# Altium project master.PrjPcb (part 4 of 4)
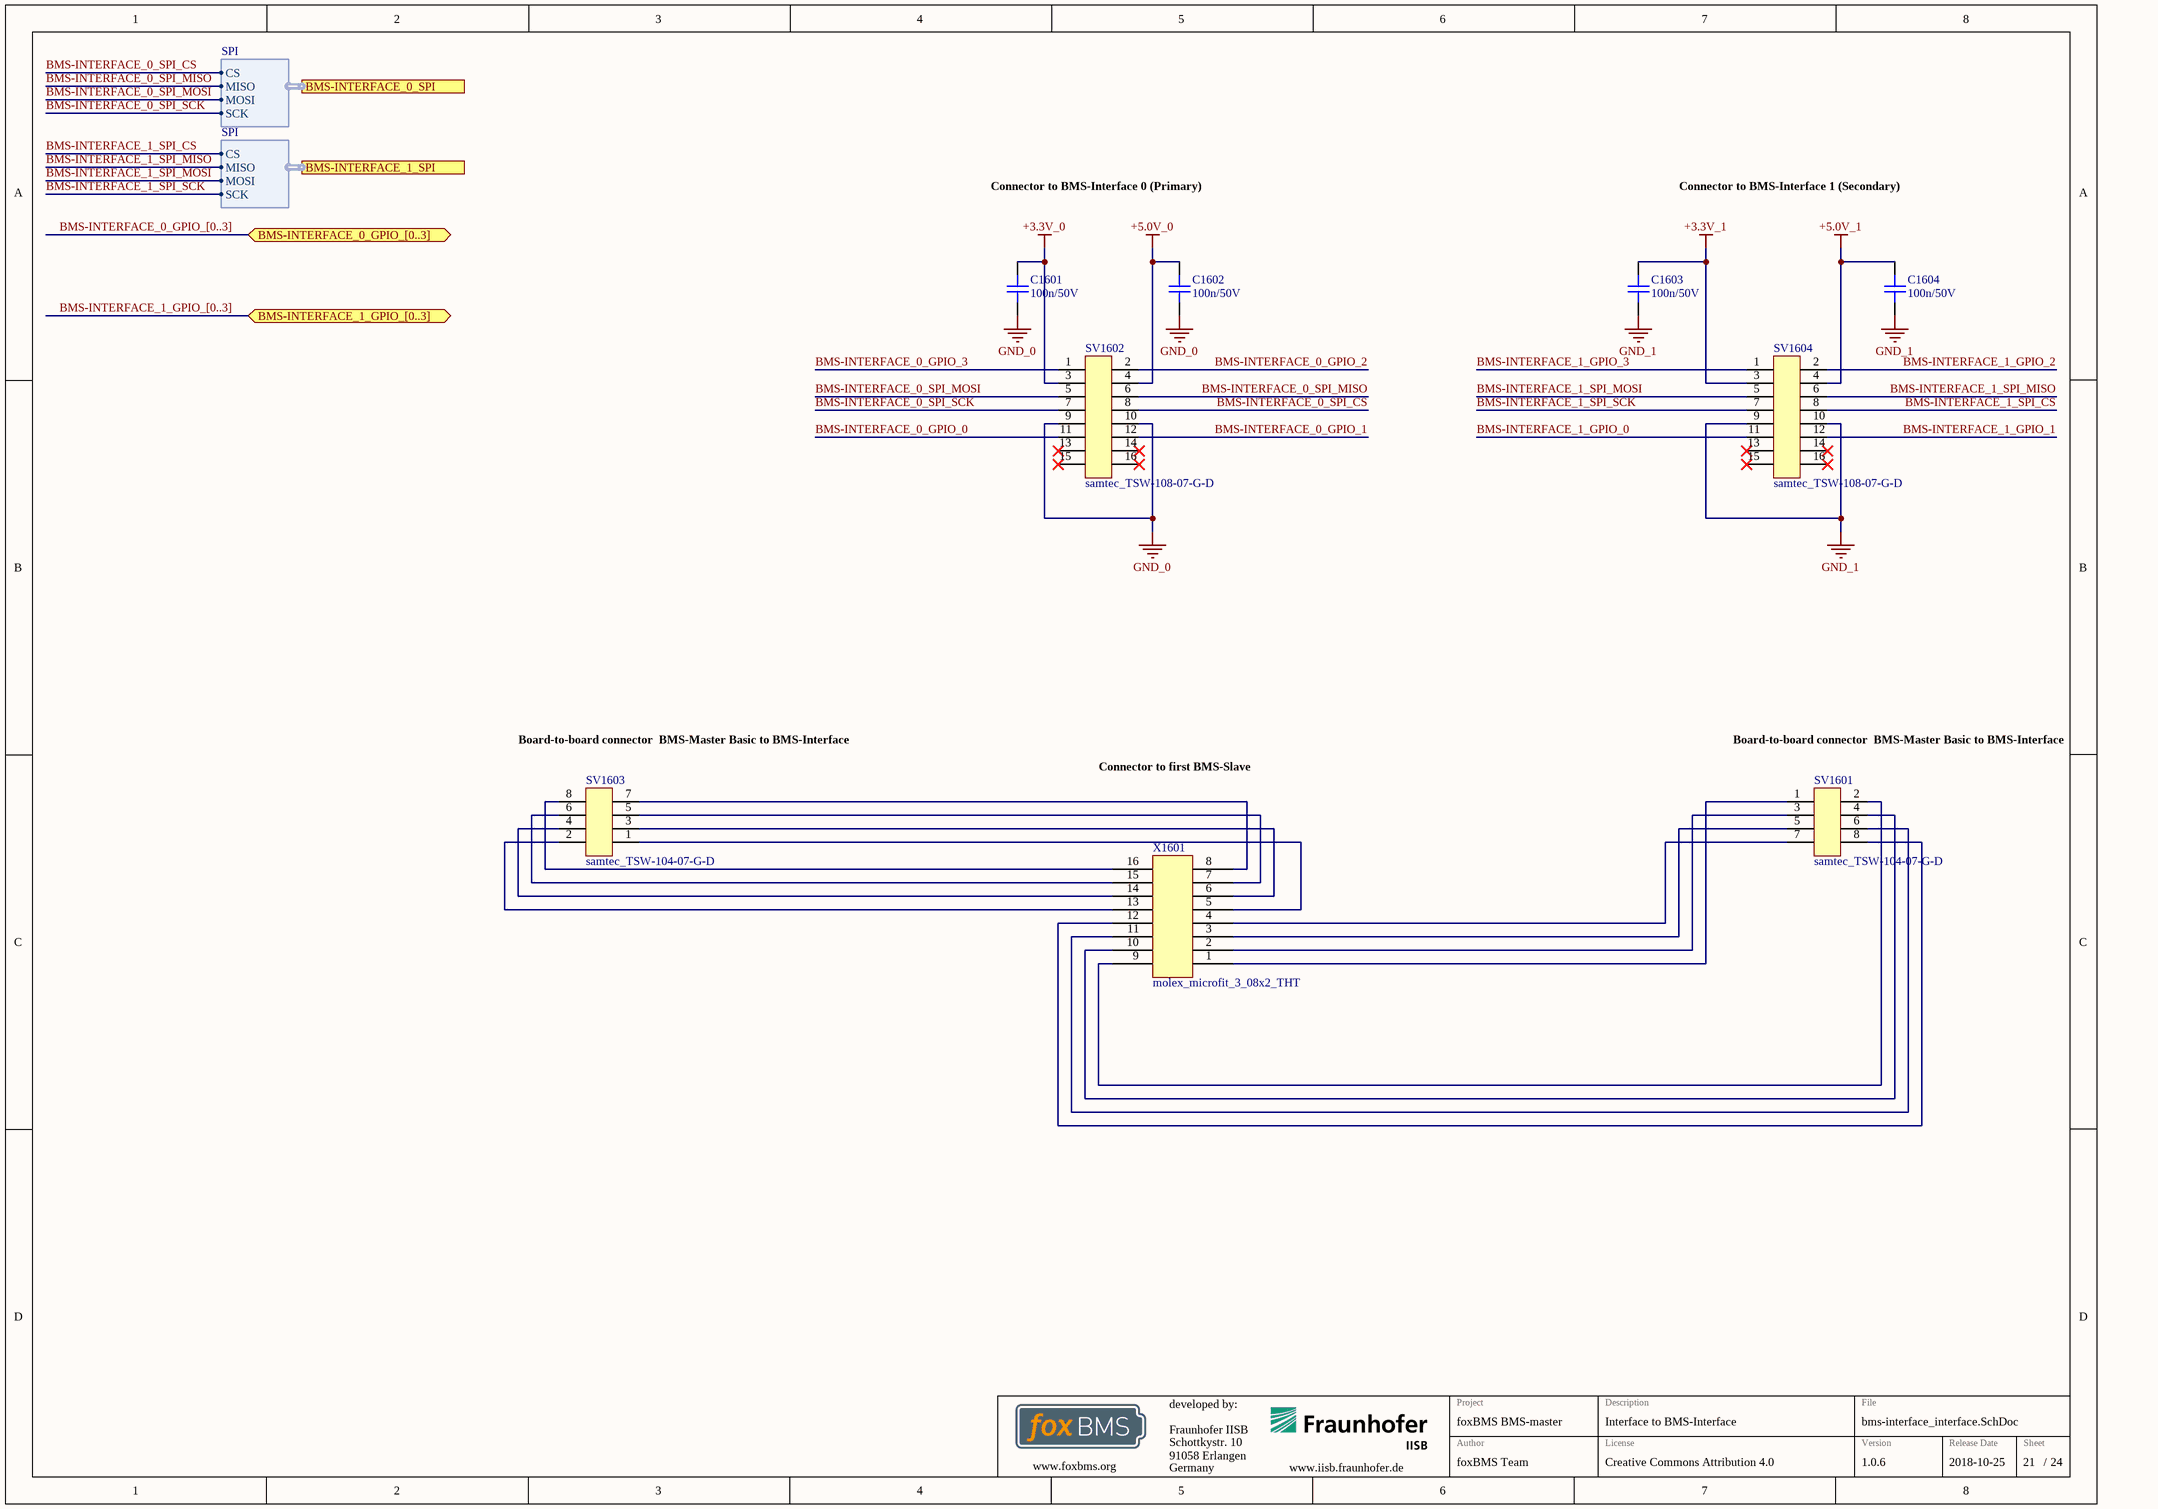
[diagram p24: bms-interface_interface.SchDoc]

## Nets that join several sheets
+3.3V_0: FPGA_SPI_interface (C2101.2 SV2101.2), supply0 (5 pins), mcu0_primary (C430.1 IC402.171 R405.2 X403.1), ext_bootload_activation (R402.2 T401.2 X402.1), power (30 pins), adc_reference (C403.1 C408.1 IC401.3 IC401.4), analog_supply_decoupling (C404.1 L401.1), SDRAM (14 pins), CAN0 (C807.2 IC802.1 IC803.1), mcu0_to_mcu1_isolated_SPI (C601.2 IC601.10 IC601.16), bender_isometer_interface (C707.1 IC702.10 IC702.16), isolated_USB (C1405.1 IC1403.10 IC1403.16), connector_to_BMS_extension (JP2201.2 JP2201.4 JP2202.2 JP2202.4), interlock_circuit (IC902.4 IC904.1), contactor_control (6 pins), contactor_feedback (6 pins), EEPROM (C1501.2 IC1501.8 R1501.2 R1502.2), bms-interface_interface (C1601.1 SV1602.3)
+3.3V_1: supply1 (5 pins), mcu0_to_mcu1_isolated_SPI (C602.1 IC601.1 IC601.7), isolated_USB (C1410.1 IC1406.10 IC1406.16), mcu1_secondary (23 pins), interlock_circuit (IC903.4 IC905.1), bms-interface_interface (C1603.1 SV1604.3)
+5.0V_0: FPGA_SPI_interface (C2102.1 SV2101.1), supply0 (5 pins), bms-interface_interface (C1602.1 SV1602.4)
+5.0V_1: supply1 (5 pins), bms-interface_interface (C1604.1 SV1604.4)
GND_0: FPGA_SPI_interface (C2101.1 C2102.2 SV2101.5 SV2101.6), supply0 (9 pins), mcu0_primary (16 pins), crystals (6 pins), debug_LED (R408.1 R409.1), ext_bootload_activation (R401.1), power (30 pins), adc_reference (5 pins), analog_supply_decoupling (C404.2 C411.2), SDRAM (14 pins), CAN0 (6 pins), mcu0_to_mcu1_isolated_SPI (C601.1 IC601.9 IC601.15), bender_isometer_interface (6 pins), isolated_USB (C1405.2 IC1403.9 IC1403.15), connector_to_BMS_extension (JP2201.1 JP2201.3 JP2202.1 JP2202.3), interlock_circuit (R903.1 R908.2 T902.S), contactor_control (12 pins), contactor_feedback (6 pins), EEPROM (C1501.1 IC1501.4), bms-interface_interface (C1601.2 C1602.2 SV1602.9 SV1602.10)
GND_1: supply1 (9 pins), mcu0_to_mcu1_isolated_SPI (C602.2 IC601.2 IC601.8), isolated_USB (C1410.2 IC1406.9 IC1406.15), mcu1_secondary (34 pins), interlock_circuit (R904.1 R911.2 T903.S), bms-interface_interface (C1603.2 C1604.2 SV1604.9 SV1604.10)
GND_EXT_0: supply0 (7 pins), supply1 (C302.2 C303.2 C304.2 IC302.1), CAN0 (13 pins), bender_isometer_interface (15 pins), interlock_circuit (SV901.2), contactor_feedback (16 pins), contactor_connectors (6 pins)
GND_EXT_2: supply0 (X201.3 X201.6), interlock_circuit (9 pins)
SUPPLY_EXT_0: supply0 (6 pins), supply1 (C302.1 C303.1 C304.1 IC302.2), CAN0 (C801.2 C802.2 IC801.1), bender_isometer_interface (C701.1 C702.1 IC701.3 X701.2), interlock_circuit (SV901.3), contactor_feedback (C1101.1 C1102.1 IC1101.3)
SUPPLY_EXT_2: supply0 (X201.1 X201.2), interlock_circuit (R901.2 SV901.5 SV901.7), contactor_control (12 pins)
ADC_MCU_0_CH_0: mcu0_primary (IC402.54), connector_to_BMS_extension (JP2202.7)
ADC_MCU_0_CH_1: mcu0_primary (IC402.55), connector_to_BMS_extension (JP2202.8)
ADC_MCU_0_CH_2: mcu0_primary (IC402.56), connector_to_BMS_extension (JP2202.5)
ADC_MCU_0_CH_3: mcu0_primary (IC402.57), connector_to_BMS_extension (JP2202.6)
ADC_MCU_0_CH_4: mcu0_primary (IC402.41), connector_to_BMS_extension (JP2202.10)
BENDER_OK: mcu0_primary (IC402.46), bender_isometer_interface (IC702.14 R708.2)
BENDER_PWM: mcu0_primary (IC402.47), bender_isometer_interface (IC702.13 R709.2)
BENDER_SUPPLY_ENABLE: mcu0_primary (IC402.43), bender_isometer_interface (IC702.12 R710.2)
BMS-INTERFACE_0_SPI_CS: mcu0_primary (IC402.50), bms-interface_interface (SV1602.8)
BMS-INTERFACE_0_SPI_MISO: mcu0_primary (IC402.52), bms-interface_interface (SV1602.6)
BMS-INTERFACE_0_SPI_MOSI: mcu0_primary (IC402.53), bms-interface_interface (SV1602.5)
BMS-INTERFACE_0_SPI_SCK: mcu0_primary (IC402.51), bms-interface_interface (SV1602.7)
BMS-INTERFACE_1_GPIO_0: mcu1_secondary (IC501.69), bms-interface_interface (SV1604.11)
BMS-INTERFACE_1_GPIO_1: mcu1_secondary (IC501.70), bms-interface_interface (SV1604.12)
BMS-INTERFACE_1_GPIO_2: mcu1_secondary (IC501.71), bms-interface_interface (SV1604.2)
BMS-INTERFACE_1_GPIO_3: mcu1_secondary (IC501.90), bms-interface_interface (SV1604.1)
BMS-INTERFACE_1_SPI_CS: mcu1_secondary (IC501.29), bms-interface_interface (SV1604.8)
BMS-INTERFACE_1_SPI_MISO: mcu1_secondary (IC501.31), bms-interface_interface (SV1604.6)
BMS-INTERFACE_1_SPI_MOSI: mcu1_secondary (IC501.32), bms-interface_interface (SV1604.5)
BMS-INTERFACE_1_SPI_SCK: mcu1_secondary (IC501.30), bms-interface_interface (SV1604.7)
BOOT_0_MCU_0: mcu0_primary (IC402.166), ext_bootload_activation (R401.2 T401.3 X402.2)
CAN_0_RX: mcu0_primary (IC402.163), CAN0 (IC802.5)
CAN_0_TRANS_STANDBY_CONTROL: mcu0_primary (IC402.141), CAN0 (R806.2)
CAN_0_TX: mcu0_primary (IC402.93), CAN0 (IC802.3)
CAN_1_RX: mcu0_primary (IC402.167), connector_to_BMS_extension (JP2201.5)
CAN_1_TRANS_STANDBY_CONTROL: mcu0_primary (IC402.165), connector_to_BMS_extension (JP2201.6)
CAN_1_TX: mcu0_primary (IC402.168), connector_to_BMS_extension (JP2201.8)
CONTACTOR_0_COIL_POS: contactor_control (D1001.1 F1001.2), contactor_connectors (X1201.3)
CONTACTOR_0_CONTROL: mcu0_primary (IC402.133), contactor_control (R1001.2)
CONTACTOR_0_FEEDBACK: mcu0_primary (IC402.128), contactor_feedback (IC1102.14)
CONTACTOR_0_FEEDBACK_EXT: contactor_feedback (R1101.1), contactor_connectors (X1201.2)
CONTACTOR_1_COIL_POS: contactor_control (D1003.1 F1003.2), contactor_connectors (X1203.3)
CONTACTOR_1_CONTROL: mcu0_primary (IC402.132), contactor_control (R1007.2)
CONTACTOR_1_FEEDBACK: mcu0_primary (IC402.129), contactor_feedback (IC1102.13)
CONTACTOR_1_FEEDBACK_EXT: contactor_feedback (R1102.1), contactor_connectors (X1203.2)
CONTACTOR_2_COIL_POS: contactor_control (D1005.1 F1005.2), contactor_connectors (X1205.3)
CONTACTOR_2_CONTROL: mcu0_primary (IC402.131), contactor_control (R1013.2)
CONTACTOR_2_FEEDBACK: mcu0_primary (IC402.130), contactor_feedback (IC1102.12)
CONTACTOR_2_FEEDBACK_EXT: contactor_feedback (R1103.1), contactor_connectors (X1205.2)
CONTACTOR_3_COIL_POS: contactor_control (D1002.1 F1002.2), contactor_connectors (X1202.3)
CONTACTOR_3_CONTROL: mcu0_primary (IC402.120), contactor_control (R1002.2)
CONTACTOR_3_FEEDBACK: mcu0_primary (IC402.115), contactor_feedback (IC1103.14)
CONTACTOR_3_FEEDBACK_EXT: contactor_feedback (R1104.2), contactor_connectors (X1202.2)
CONTACTOR_4_COIL_POS: contactor_control (D1004.1 F1004.2), contactor_connectors (X1204.3)
CONTACTOR_4_CONTROL: mcu0_primary (IC402.119), contactor_control (R1008.2)
CONTACTOR_4_FEEDBACK: mcu0_primary (IC402.116), contactor_feedback (IC1103.13)
CONTACTOR_4_FEEDBACK_EXT: contactor_feedback (R1105.2), contactor_connectors (X1204.2)
CONTACTOR_5_COIL_POS: contactor_control (D1006.1 F1006.2), contactor_connectors (X1206.3)
CONTACTOR_5_CONTROL: mcu0_primary (IC402.118), contactor_control (R1014.2)
CONTACTOR_5_FEEDBACK: mcu0_primary (IC402.117), contactor_feedback (IC1103.12)
CONTACTOR_5_FEEDBACK_EXT: contactor_feedback (R1106.2), contactor_connectors (X1206.2)
CONTACTOR_6_CONTROL: mcu0_primary (IC402.139), connector_to_BMS_extension (JP2201.17)
CONTACTOR_6_FEEDBACK: mcu0_primary (IC402.140), connector_to_BMS_extension (JP2201.18)
CONTACTOR_7_CONTROL: mcu0_primary (IC402.144), connector_to_BMS_extension (JP2201.15)
CONTACTOR_7_FEEDBACK: mcu0_primary (IC402.164), connector_to_BMS_extension (JP2201.16)
CONTACTOR_8_CONTROL: mcu0_primary (IC402.44), connector_to_BMS_extension (JP2202.9)
CONTACTOR_8_FEEDBACK: mcu0_primary (IC402.45), connector_to_BMS_extension (JP2202.12)
CONTACTORS_COMMON_NEG: interlock_circuit (T901.4), contactor_control (6 pins), contactor_connectors (6 pins)
DATA_STORAGE_SPI_EEPROM_CS: mcu0_primary (IC402.7), EEPROM (IC1501.1)
DATA_STORAGE_SPI_Memory_NSS: mcu0_primary (IC402.11), connector_to_BMS_extension (JP2201.24)
DATA_STORAGE_SPI_MISO: mcu0_primary (IC402.155), connector_to_BMS_extension (JP2201.22), EEPROM (IC1501.2)
DATA_STORAGE_SPI_MOSI: mcu0_primary (IC402.157), connector_to_BMS_extension (JP2201.20), EEPROM (IC1501.5)
DATA_STORAGE_SPI_SCK: mcu0_primary (IC402.156), connector_to_BMS_extension (JP2201.19), EEPROM (IC1501.6)
DEBUG_LED_0_MCU_0: mcu0_primary (IC402.35), debug_LED (LED402.2)
DEBUG_LED_1_MCU_0: mcu0_primary (IC402.34), debug_LED (LED401.2)
FMC_MCU_0_RAM_A0: mcu0_primary (IC402.16), SDRAM (IC1801.23)
FMC_MCU_0_RAM_A1: mcu0_primary (IC402.17), SDRAM (IC1801.24)
FMC_MCU_0_RAM_A2: mcu0_primary (IC402.18), SDRAM (IC1801.25)
FMC_MCU_0_RAM_A3: mcu0_primary (IC402.19), SDRAM (IC1801.26)
FMC_MCU_0_RAM_A4: mcu0_primary (IC402.20), SDRAM (IC1801.29)
FMC_MCU_0_RAM_A5: mcu0_primary (IC402.21), SDRAM (IC1801.30)
FMC_MCU_0_RAM_A6: mcu0_primary (IC402.60), SDRAM (IC1801.31)
FMC_MCU_0_RAM_A7: mcu0_primary (IC402.63), SDRAM (IC1801.32)
FMC_MCU_0_RAM_A8: mcu0_primary (IC402.64), SDRAM (IC1801.33)
FMC_MCU_0_RAM_A9: mcu0_primary (IC402.65), SDRAM (IC1801.34)
FMC_MCU_0_RAM_A10: mcu0_primary (IC402.66), SDRAM (IC1801.22)
FMC_MCU_0_RAM_A11: mcu0_primary (IC402.67), SDRAM (IC1801.35)
FMC_MCU_0_RAM_BA0: mcu0_primary (IC402.108), SDRAM (IC1801.20)
FMC_MCU_0_RAM_BA1: mcu0_primary (IC402.109), SDRAM (IC1801.21)
FMC_MCU_0_RAM_D0: mcu0_primary (IC402.104), SDRAM (IC1801.2)
FMC_MCU_0_RAM_D1: mcu0_primary (IC402.105), SDRAM (IC1801.4)
FMC_MCU_0_RAM_D2: mcu0_primary (IC402.142), SDRAM (IC1801.5)
FMC_MCU_0_RAM_D3: mcu0_primary (IC402.143), SDRAM (IC1801.7)
FMC_MCU_0_RAM_D4: mcu0_primary (IC402.68), SDRAM (IC1801.8)
FMC_MCU_0_RAM_D5: mcu0_primary (IC402.69), SDRAM (IC1801.10)
FMC_MCU_0_RAM_D6: mcu0_primary (IC402.70), SDRAM (IC1801.11)
FMC_MCU_0_RAM_D7: mcu0_primary (IC402.73), SDRAM (IC1801.13)
FMC_MCU_0_RAM_D8: mcu0_primary (IC402.74), SDRAM (IC1801.42)
FMC_MCU_0_RAM_D9: mcu0_primary (IC402.75), SDRAM (IC1801.44)
FMC_MCU_0_RAM_D10: mcu0_primary (IC402.76), SDRAM (IC1801.45)
FMC_MCU_0_RAM_D11: mcu0_primary (IC402.77), SDRAM (IC1801.47)
FMC_MCU_0_RAM_D12: mcu0_primary (IC402.78), SDRAM (IC1801.48)
FMC_MCU_0_RAM_D13: mcu0_primary (IC402.96), SDRAM (IC1801.50)
FMC_MCU_0_RAM_D14: mcu0_primary (IC402.97), SDRAM (IC1801.51)
FMC_MCU_0_RAM_D15: mcu0_primary (IC402.98), SDRAM (IC1801.53)
FMC_MCU_0_RAM_NBL0: mcu0_primary (IC402.169), SDRAM (IC1801.15)
FMC_MCU_0_RAM_NBL1: mcu0_primary (IC402.170), SDRAM (IC1801.39)
FMC_MCU_0_RAM_SDCKE1: mcu0_primary (IC402.84), SDRAM (IC1801.37)
FMC_MCU_0_RAM_SDCLK: mcu0_primary (IC402.112), SDRAM (IC1801.38)
FMC_MCU_0_RAM_SDNCAS: mcu0_primary (IC402.160), SDRAM (IC1801.17)
FMC_MCU_0_RAM_SDNE1: mcu0_primary (IC402.83), SDRAM (IC1801.19)
FMC_MCU_0_RAM_SDNRAS: mcu0_primary (IC402.59), SDRAM (IC1801.18)
FMC_MCU_0_RAM_SDNWE: mcu0_primary (IC402.32), SDRAM (IC1801.16)
FTDI_MCU_0_DTR: ext_bootload_activation (R402.1 T401.1), isolated_USB (IC1403.13)
FTDI_MCU_0_RTS: mcu0_primary (R403.2), isolated_USB (IC1403.14)
FTDI_MCU_0_RX: mcu0_primary (IC402.80), isolated_USB (IC1403.12)
FTDI_MCU_0_TX: mcu0_primary (IC402.79), isolated_USB (IC1403.11)
FTDI_MCU_1_DTR: isolated_USB (IC1406.13), mcu1_secondary (R504.1 T501.1)
FTDI_MCU_1_RTS: isolated_USB (IC1406.14), mcu1_secondary (R501.2)
FTDI_MCU_1_RX: isolated_USB (IC1406.12), mcu1_secondary (IC501.48)
FTDI_MCU_1_TX: isolated_USB (IC1406.11), mcu1_secondary (IC501.47)
HSE_1_MCU_0: mcu0_primary (IC402.29), crystals (C402.2 Q401.1)
HSE_2_MCU_0: mcu0_primary (IC402.30), crystals (C414.1 Q401.3)
INTERLOCK_CONTROL_MCU_0: mcu0_primary (IC402.146), interlock_circuit (R909.2)
INTERLOCK_CONTROL_MCU_1: mcu1_secondary (IC501.85), interlock_circuit (R912.2)
INTERLOCK_FEEDBACK_MCU_0: mcu0_primary (IC402.147), interlock_circuit (IC902.3 R903.2)
INTERLOCK_FEEDBACK_MCU_1: mcu1_secondary (IC501.86), interlock_circuit (IC903.3 R904.2)
ISO_GPIO_MCU_0_IN_0: mcu0_primary (IC402.100), connector_to_BMS_extension (JP2202.21)
ISO_GPIO_MCU_0_IN_1: mcu0_primary (IC402.101), connector_to_BMS_extension (JP2202.24)
ISO_GPIO_MCU_0_IN_2: mcu0_primary (IC402.154), connector_to_BMS_extension (JP2201.14)
ISO_GPIO_MCU_0_IN_3: mcu0_primary (IC402.173), connector_to_BMS_extension (JP2201.9)
ISO_GPIO_MCU_0_OUT_0: mcu0_primary (IC402.152), connector_to_BMS_extension (JP2201.10)
ISO_GPIO_MCU_0_OUT_1: mcu0_primary (IC402.153), connector_to_BMS_extension (JP2201.13)
ISO_GPIO_MCU_0_OUT_2: mcu0_primary (IC402.174), connector_to_BMS_extension (JP2201.12)
ISO_GPIO_MCU_0_OUT_3: mcu0_primary (IC402.175), connector_to_BMS_extension (JP2201.11)
ISONOC_0_CONTROL: mcu0_primary (IC402.85), connector_to_BMS_extension (JP2202.15)
ISONOC_1_CONTROL: mcu0_primary (IC402.86), connector_to_BMS_extension (JP2202.18)
ISONOC_2_CONTROL: mcu0_primary (IC402.87), connector_to_BMS_extension (JP2202.17)
ISONOC_3_CONTROL: mcu0_primary (IC402.88), connector_to_BMS_extension (JP2202.20)
ISONOC_4_CONTROL: mcu0_primary (IC402.89), connector_to_BMS_extension (JP2202.19)
ISONOC_5_CONTROL: mcu0_primary (IC402.99), connector_to_BMS_extension (JP2202.22)
LSE_1_MCU_0: mcu0_primary (IC402.9), crystals (C428.2 Q402.2)
LSE_2_MCU_0: mcu0_primary (IC402.10), crystals (C429.1 Q402.1)
MCU_TO_FPGA_INTERFACE_MCU_0_CS: FPGA_SPI_interface (SV2101.7), mcu0_primary (IC402.24)
MCU_TO_FPGA_INTERFACE_MCU_0_MISO: FPGA_SPI_interface (SV2101.4), mcu0_primary (IC402.26)
MCU_TO_FPGA_INTERFACE_MCU_0_MOSI: FPGA_SPI_interface (SV2101.8), mcu0_primary (IC402.27)
MCU_TO_FPGA_INTERFACE_MCU_0_SCK: FPGA_SPI_interface (SV2101.3), mcu0_primary (IC402.25)
MCU_TO_MCU_INTERFACE_MCU_0_CS: mcu0_primary (IC402.92), mcu0_to_mcu1_isolated_SPI (IC601.12)
MCU_TO_MCU_INTERFACE_MCU_0_MISO: mcu0_primary (IC402.94), mcu0_to_mcu1_isolated_SPI (IC601.11)
MCU_TO_MCU_INTERFACE_MCU_0_MOSI: mcu0_primary (IC402.95), mcu0_to_mcu1_isolated_SPI (IC601.14)
MCU_TO_MCU_INTERFACE_MCU_0_SCK: mcu0_primary (IC402.145), mcu0_to_mcu1_isolated_SPI (IC601.13)
MCU_TO_MCU_INTERFACE_MCU_1_CS: mcu0_to_mcu1_isolated_SPI (IC601.5), mcu1_secondary (IC501.51)
MCU_TO_MCU_INTERFACE_MCU_1_MISO: mcu0_to_mcu1_isolated_SPI (IC601.6), mcu1_secondary (IC501.53)
MCU_TO_MCU_INTERFACE_MCU_1_MOSI: mcu0_to_mcu1_isolated_SPI (IC601.3), mcu1_secondary (IC501.54)
MCU_TO_MCU_INTERFACE_MCU_1_SCK: mcu0_to_mcu1_isolated_SPI (IC601.4), mcu1_secondary (IC501.84)
Memory_SUPPLY_CONTROL: mcu0_primary (IC402.33), connector_to_BMS_extension (JP2201.21)
RS485_MCU_0_DE: mcu0_primary (IC402.107), connector_to_BMS_extension (JP2202.16)
RS485_MCU_0_NRE: mcu0_primary (IC402.106), connector_to_BMS_extension (JP2202.13)
RS485_MCU_0_RX: mcu0_primary (IC402.150), connector_to_BMS_extension (JP2202.14)
RS485_MCU_0_TX: mcu0_primary (IC402.42), connector_to_BMS_extension (JP2202.11)
VDDA_MCU_0: power (IC402.39), analog_supply_decoupling (C411.1 L401.2)
VREF+_MCU_0: power (C423.1 C424.1 IC402.38), adc_reference (C422.1 IC401.5 IC401.6)

## Assembly variants
default: not fitted D1001 D1002 D1003 D1004 D1005 D1006 SV501 X902